# Altium schematic sheet LeftBar2_SchDoc.SchDoc
size A4
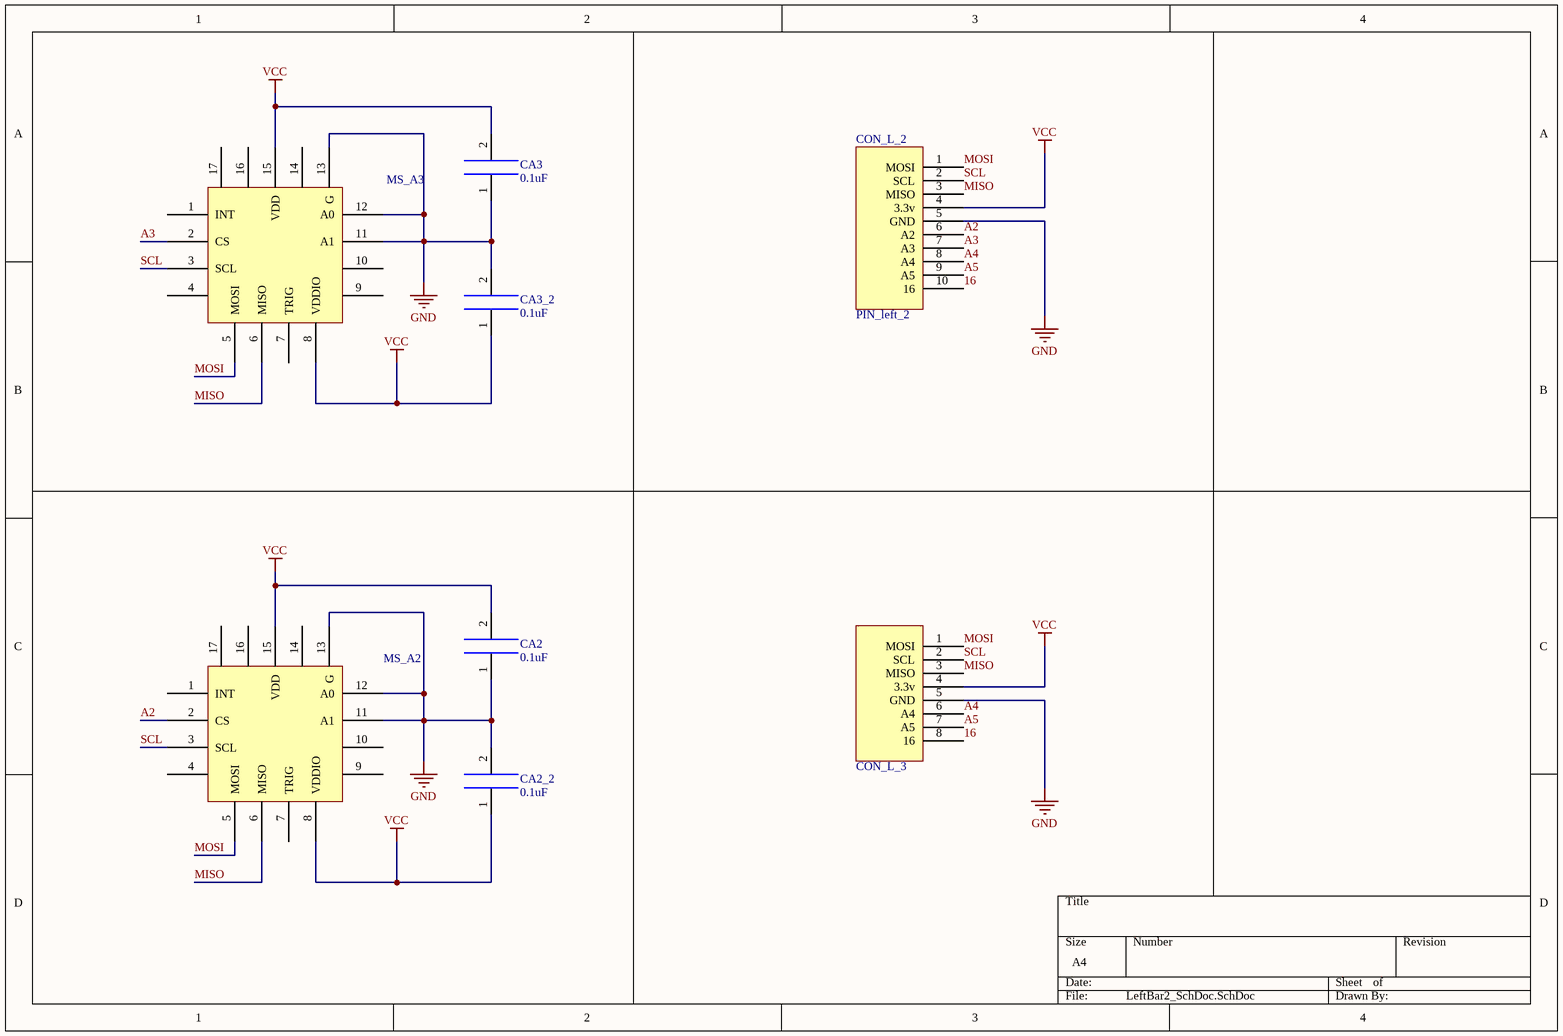
[diagram p0: LeftBar2_SchDoc.SchDoc]

## Parts
CA2  0.1uF  [CAP_0603]
CA2_2  0.1uF  [CAP_0603]
CA3  0.1uF  [CAP_0603]
CA3_2  0.1uF  [CAP_0603]
CON_L_2  PIN_left_2  [PIN_Left_2]
CON_L_3  PIN_left  [PIN_Left_3]  (value not drawn)
MS_A2  MLX90393SLW ABA 011 RE  [MLX90393]  (value not drawn)
MS_A3  MLX90393SLW ABA 011 RE  [MLX90393]  (value not drawn)

## Nets
GND: CA2.1 CA2_2.2 CA3.1 CA3_2.2 CON_L_2.5(GND) CON_L_3.5(GND) MS_A2.11(A1) MS_A2.12(A0) MS_A2.13(G) MS_A3.11(A1) MS_A3.12(A0) MS_A3.13(G)
VCC: CA2.2 CA2_2.1 CA3.2 CA3_2.1 CON_L_2.4(3.3v) CON_L_3.4(3.3v) MS_A2.8(VDDIO) MS_A2.15(VDD) MS_A3.8(VDDIO) MS_A3.15(VDD)
16: CON_L_2.10(16) CON_L_3.8(16)
A2: CON_L_2.6(A2) MS_A2.2(CS)
A3: CON_L_2.7(A3) MS_A3.2(CS)
A4: CON_L_2.8(A4) CON_L_3.6(A4)
A5: CON_L_2.9(A5) CON_L_3.7(A5)
MISO: CON_L_2.3(MISO) CON_L_3.3(MISO) MS_A2.6(MISO) MS_A3.6(MISO)
MOSI: CON_L_2.1(MOSI) CON_L_3.1(MOSI) MS_A2.5(MOSI) MS_A3.5(MOSI)
SCL: CON_L_2.2(SCL) CON_L_3.2(SCL) MS_A2.3(SCL) MS_A3.3(SCL)

Not connected (* = marked no-connect by the designer): MS_A2 1(INT) 4 7(TRIG) 9 10 14 16 17; MS_A3 1(INT) 4 7(TRIG) 9 10 14 16 17

## Library data of the parts
CA2 CA2_2 CA3 CA3_2 = CAP: Capacitance
CON_L_3 = PIN_left_3
MS_A2 MS_A3 = MLX90393SLW ABA 011 RE: MLX90393 Sensor